# Altium schematic sheet TPS61021ADSGR - 2V5 BOOST.SchDoc
size A3; SheetNumber: 6; SheetTotal: 7
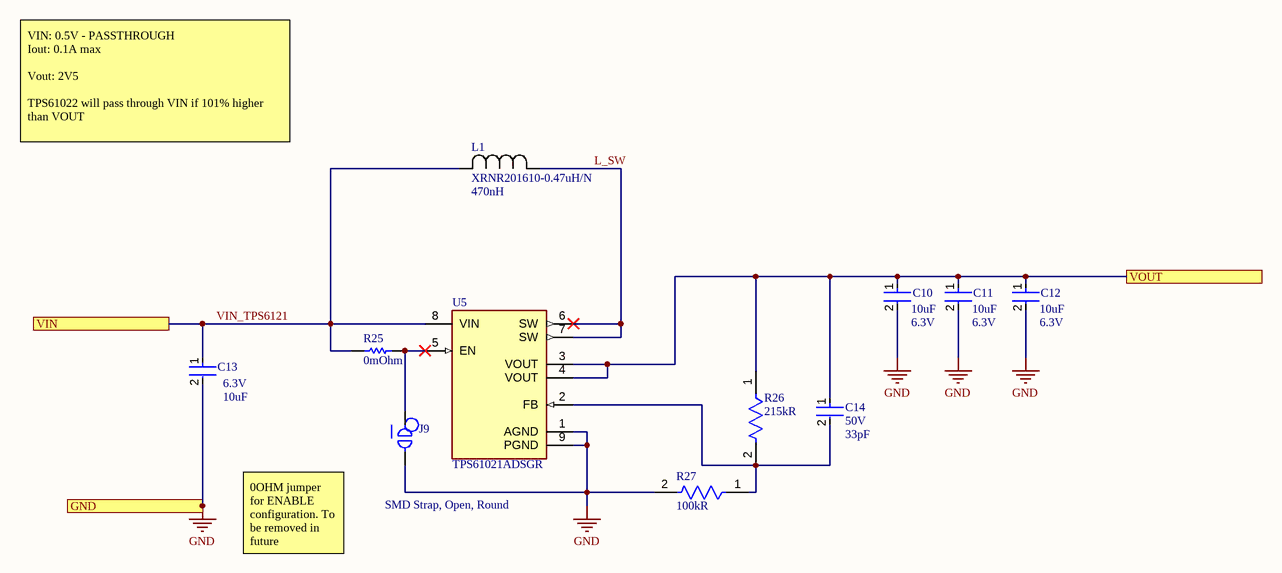
[diagram p0: TPS61021ADSGR - 2V5 BOOST.SchDoc]

## Parts
C10  Capacitance: 10uF  Voltage: 6.3V  [FP-C0805C106K9PACTU-MFG]  (hidden comment: C0805C106K9PACTU)
C11  Capacitance: 10uF  Voltage: 6.3V  [FP-C0805C106K9PACTU-MFG]  (hidden comment: C0805C106K9PACTU)
C12  Capacitance: 10uF  Voltage: 6.3V  [FP-C0805C106K9PACTU-MFG]  (hidden comment: C0805C106K9PACTU)
C13  Capacitance: 10uF  Voltage Rating: 6.3V  [FP-GRJ155-0_2-MFG]  (hidden comment: GRJ155R60J106ME11D)
C14  Voltage Rating (DC): 50V  Capacitance: 33pF  [FP-CL790-IPC_C]  (hidden comment: CL05C330JB5NNNC)
J9  SMD Strap, Open, Round  [Open Link, Atmel Design]  (net tie, no BOM)
L1  XRNR201610-0.47uH/N  Inductance: 470nH  [XRNR201610-0.47uH/N]
R25  Resistance: 0mOhm  [RESC1005X40X25LL05T05]  (hidden comment: ERJ2GE0R00X)
R26  Resistance: 215kR  [FP-CRCW0402-e3-IPC_C]  (hidden comment: CRCW0402215KFKED)
R27  Resistance: 100kR  [FP-CRCW0402-e3-IPC_C]  (hidden comment: CRCW0402100KFKED)
U5  TPS61021ADSGR  [FP-DSG0008A-IPC_B]

## Ports
GND, VIN, VOUT

## Nets
GND: C10.2 C11.2 C12.2 C13.2 J9.2 R27.2 U5.1(AGND) U5.9(PGND) ; port GND
L_SW: L1.1 U5.6(SW) U5.7(SW)
VIN_TPS6121: C13.1 L1.2 R25.2 U5.8(VIN) ; port VIN
VOUT: C10.1 C11.1 C12.1 C14.1 R26.1 U5.3(VOUT) U5.4(VOUT) ; port VOUT
NetC14_2: C14.2 R26.2 R27.1 U5.2(FB)
NetJ9_1: J9.1 R25.1 U5.5(EN)

## Notes on the sheet
- VIN: 0.5V - PASSTHROUGH
  Iout: 0.1A max
  Vout: 2V5
  TPS61022 will pass through VIN if 101% higher than VOUT
- 0OHM jumper for ENABLE configuration. To be removed in future
- Sheet Title
- PCB Project Name
- Modified
- Sheet
- of

## Library data of the parts
C10-C12 = CMP-03020-034676-1: CAP CER 10UF 6.3V X5R 0805; Dielectric Material: Ceramic; Dissipation Factor: 5%; Tolerance: 10%; Thickness: 0.055inch; Mount: Surface Mount; Case Code (Imperial): 0805; Lead Pitch: 0.75mm; Height: 1.25mm; Construction: Flat; Number of Pins: 2; Contact Material: Tin; Case/Package: 0805; Case Code (Metric): 2012; Termination: SMD/SMT; Width: 1.2mm; Dielectric: X5R; Lead Free: Lead Free; Min Operating Temperature: -55°C; Voltage Rating (DC): 6.3V; Series: C; Packaging: Tape and Reel; Radiation Hardening: No; Length: 2mm; REACH SVHC: No SVHC; RoHS Compliant: Yes; Max Operating Temperature: 85°C; Package Quantity: 1; Voltage Rating: 6.3V; Depth: 1.25mm
C13 = CMP-06035-062410-1: CAP CER 10UF 6.3V X5R 0402; Tolerance: 20%; Length: 0.039inch; Width: 0.02inch; Max Operating Temperature: 85°C; Features: Soft Termination; Case Code (Metric): 1005; Min Operating Temperature: -55°C; Thickness: 0.028inch; Mount: Surface Mount; Packaging: Cut Tape; Case/Package: 0402; Case Code (Imperial): 0402; RoHS Compliant: Yes
C14 = CMP-13271-001471-1: Cap Ceramic 33pF 50V C0G ±5% SMD 0402 +125°C Paper T/R; Temperature Coefficient: 300ppm/°C; Dielectric: C0G; Height: 0.5mm; Tolerance: 5%; Package Quantity: 1; Mount: Surface Mount; Material: Ceramic; Min Operating Temperature: -55°C; Thickness: 0.022inch; Case/Package: 0402; Width: 0.02inch; Depth: 0.5mm; Lead Free: Lead Free; Max Operating Temperature: 125°C; Voltage: 50V; Case Code (Metric): 1005; Case Code (Imperial): 0402; Packaging: Tape and Reel; Voltage Rating: 50V; Contact Plating: Tin; Radiation Hardening: No; Length: 1mm
J9 = CMP-001-0038-01.A.1
L1 = XRNR201610-0.47uH/N: 2.35A 2.3A 470nH 59mΩ Magnetic Shielded Inductor ±30% SMD-2P,2x1.6mm Power Inductors ROHS; Manufacturer: Inpaq; Manufacturer Part Number: WIP252012S-1R5MLDG; Supplier: Digikey; Supplier Part Number: 3526-WIP252012S-1R5MLDGCT-ND; RoHS: No; Category: Fixed Inductors
R25 = CMP-2000-07451-1: Chip Resistor, 0 Ohm, 0.1 W, -55 to 155 degC, 0402 (1005 Metric), RoHS, Tape and Reel; Manufacturer: Panasonic; Voltage Rating (DC): 50V; Temperature Coefficient: 600ppm/��C; Max Power Dissipation: 100mW; Tolerance: 5%; Number of Terminations: 2; Mount: SurfaceMount; Height: 0.35mm; Packaging: TapeandReel; Contact Plating: Tin; Manufacturer URL: http://www.panasonic.com/; Composition: ThickFilm; Max Operating Temperature: 155degC; REACH SVHC: NoSVHC; Case/Package: 0402; Package Reference: 402; Depth: 0.5mm; Package Description: 2-Pin Surface Mount Device, Body 1 x 0.5 mm; Datasheet URL: https://industrial.panasonic.com/cdbs/www-data/pdf/RDA0000/AOA0000C301.pdf; RoHSCompliant: True; Case Code (Imperial): 0402; Military Standard: Not; Min Operating Temperature: -55degC; Power Rating: 100mW; Datasheet Version: 03/2015; Length: 1mm; Case Code (Metric): 1005; Termination: SMD/SMT; Mounting Technology: SurfaceMount; Voltage Rating: 50V; Width: 0.02inch; Package Quantity: 1; Lead Free: LeadFree; Radiation Hardening: No
R26 = CMP-2002-08364-2: RES Thick Film, 215kΩ, 1%, 0.063W, 100ppm/°C, 0402; Max Power Dissipation: 63mW; Voltage Rating: 50V; Number of Terminations: 2; Contact Plating: Tin; Mount: Surface Mount; Features: Automotive AEC-Q200; Weight: 2.3E-05oz; Tolerance: 1%; Packaging: Tape and Reel; Min Operating Temperature: -55°C; Case Code (Imperial): 0402; Width: 0.02inch; Case/Package: 0402; Max Operating Temperature: 155°C; Height: 0.35mm; Depth: 0.5mm; Number of Pins: 2; Power Rating: 63mW; Composition: Thick Film; Termination: SMD/SMT; Military Standard: Not; Temperature Coefficient: 100ppm/°C; Package Quantity: 10; Length: 1mm; Case Code (Metric): 1005
R27 = CMP-2002-08123-3: RES Thick Film, 100kΩ, 1%, 0.063W, 100ppm/°C, 0402; Power Rating: 63mW; Voltage Rating (DC): 50V; Lead Free: Lead Free; Height: 0.35mm; Contact Plating: Tin; Min Operating Temperature: -55°C; Package Quantity: 10000; Case/Package: 0402; Temperature Coefficient: 100ppm/°C; Number of Terminations: 2; Packaging: Tape and Reel; Max Power Dissipation: 63mW; Case Code (Metric): 1005; Mount: Surface Mount; Width: 0.02inch; Termination: SMD/SMT; Length: 1mm; Number of Pins: 2; Weight: 2.3E-05oz; Radiation Hardening: No; Tolerance: 1%; Military Standard: Not; Features: Automotive AEC-Q200; Depth: 0.5mm; Composition: Thick Film; Max Operating Temperature: 155°C; Voltage Rating: 50V; Case Code (Imperial): 0402
U5 = CMP-04918-000096-1: IC REG BOOST ADJUSTABLE 3A 8WSON; Manufacturer: Texas Instruments; Output Voltage: 1.8-4V; Standoff Height: 0mm; Switching Frequency: 2MHz; Number Of Outputs: 1; Max Duty Cycle: 90%; Max Supply Voltage: 4.4V; Output Type: AdjustableProgrammable; Output Current: 1.5A; Nominal Supply Current: 17uA; Min Supply Voltage: 0.5V; Max Junction Temp: +125°C; Category: IC; RoHS: TRUE; Device Class L2: Power Management ICs; Temperature: -40°C to +125°C; Automotive: No; Height: 0.8mm; Device Class L3: Voltage Regulators - Switching; Lead Free: Yes; Ipc Land Pattern Name: DFN200X200X80-8; ComponentLink2URL: http://www.ti.com/lit/ds/symlink/tps61021a.pdf; Package: DSG0008A; Switching Topology: Boost; Manufacturer Part Number: TPS61021ADSGR; ComponentLink2Description: Datasheet; Device Class L1: Integrated Circuits (ICs); Mouser Description: 3-A Boost Converter with 0.5-V Ultra Low Input Voltage 8-WSON -40 to 125; Octopart: https://octopart.com/tps61021adsgr-texas+instruments-74531141; Digikey Description: IC REG BOOST ADJUSTABLE 3A 8WSON; Temperature Range Low: -40°C; Temperature Range High: +125°C